# EAGLE design programmer (EAGLE 6.2)
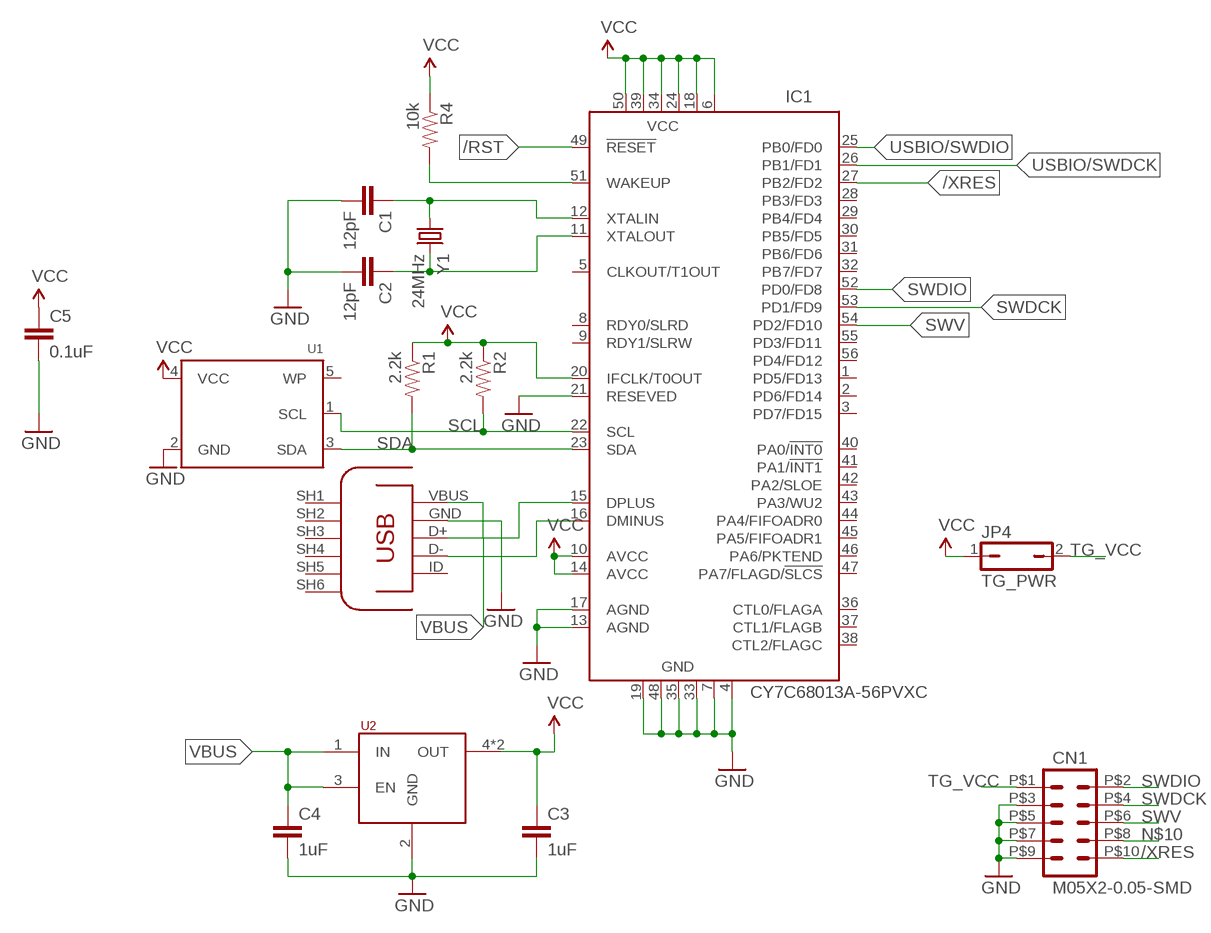
[diagram p0: schematic, sheet 1]

## Parts
C1  12pF  CAP0805  [0805]
C2  12pF  CAP0805  [0805]
C3  1uF  CAP0805  [0805]
C4  1uF  CAP0805  [0805]
C5  0.1uF  CAP0805  [0805]
CN1  M05X2-0.05-SMD  [PINHD-2X5-0.05-SMD]
IC1  CY7C68013A-56PVXC  [SSOP56]
JP4  TG_PWR  JP1Q  [JP1]
R1  2.2k  RESISTOR0805-RES  [0805]
R2  2.2k  RESISTOR0805-RES  [0805]
R4  10k  RESISTOR0805-RES  [0805]
U1  EEPROM_I2C_MCP24AA32  [SOT23-5]
U2  TLV702XX  [SOT23-5]
U$3  MICROUSB  [USB-MICROB]
Y1  24MHz  XRCGB_XTAL  [XRCGB-XTAL]

## Nets
/RST: IC1.49(!RESET)
/XRES: CN1.P$10 IC1.27(PB2/FD2)
GND: C1.2 C2.2 C3.2 C4.2 C5.2 CN1.P$3 CN1.P$5 CN1.P$7 CN1.P$9 IC1.4(GND) IC1.7(GND) IC1.13(AGND) IC1.17(AGND) IC1.19(GND) IC1.21(RESEVED) IC1.33(GND) IC1.35(GND) IC1.48(GND) U1.2(GND) U2.2(GND) U$3.GND
N$1: IC1.16(DMINUS) U$3.D-
N$2: IC1.15(DPLUS) U$3.D+
N$3: IC1.51(WAKEUP) R4.2
N$10: CN1.P$8
SCL: IC1.22(SCL) R2.2 U1.1(SCL)
SDA: IC1.23(SDA) R1.2 U1.3(SDA)
SWDCK: CN1.P$4 IC1.53(PD1/FD9)
SWDIO: CN1.P$2 IC1.52(PD0/FD8)
SWV: CN1.P$6 IC1.54(PD2/FD10)
TG_VCC: CN1.P$1 JP4.2
USBIO/SWDCK: IC1.26(PB1/FD1)
USBIO/SWDIO: IC1.25(PB0/FD0)
VBUS: C4.1 U2.1(IN) U2.3(EN) U$3.VBUS(VCC)
VCC: C3.1 C5.1 IC1.6(VCC) IC1.10(AVCC) IC1.14(AVCC) IC1.18(VCC) IC1.20(IFCLK/T0OUT) IC1.24(VCC) IC1.34(VCC) IC1.39(VCC) IC1.50(VCC) JP4.1 R1.1 R2.1 R4.1 U1.4(VCC) U2.4(OUT) U2.5(OUT)
XTALIN: C1.1 IC1.12(XTALIN) Y1.1
XTALOUT: C2.1 IC1.11(XTALOUT) Y1.2
Unconnected: IC1.1(PD5/FD13) IC1.2(PD6/FD14) IC1.3(PD7/FD15) IC1.5(CLKOUT/T1OUT) IC1.8(RDY0/SLRD) IC1.9(RDY1/SLRW) IC1.28(PB3/FD3) IC1.29(PB4/FD4) IC1.30(PB5/FD5) IC1.31(PB6/FD6) IC1.32(PB7/FD7) IC1.36(CTL0/FLAGA) IC1.37(CTL1/FLAGB) IC1.38(CTL2/FLAGC) IC1.40(PA0/!INT0) IC1.41(PA1/!INT1) IC1.42(PA2/SLOE) IC1.43(PA3/WU2) IC1.44(PA4/FIFOADR0) IC1.45(PA5/FIFOADR1) IC1.46(PA6/PKTEND) IC1.47(PA7/FLAGD/!SLCS) IC1.55(PD3/FD11) IC1.56(PD4/FD12) U1.5(WP) U$3.ID U$3.SH1(SH) U$3.SH2(SH) U$3.SH3(SH) U$3.SH4(SH) U$3.SH5(SH) U$3.SH6(SH)

## Library data of the parts
C1-C5 = SparkFun-Passives:CAP: Capacitor Standard 0603 ceramic capacitor, and 0.1" leaded capacitor.
CN1 = nickparts:M05X2-0.05-SMD
IC1 = my_cypress:CY7C6801*A-56: EZ-USB FX2LP (TM) USB Microcontroller Source: http://www.cypress.com .. cy7c68013a_5.pdf; MF: CYPRESS SEMICONDUCTOR CORPORAT; MPN: CY7C68013A-56PVXC; OC_FARNELL: 1269134; OC_NEWARK: 19M7114
JP4 = jumper:JP1Q: JUMPER
R1 R2 R4 = SparkFun-Passives:RESISTOR: Resistor Basic schematic elements and footprints for 0603, 1206, and PTH resistors.
U1 = microbuilder:EEPROM_I2C_MCP24AA32: Microchip 32K (4K x 8) 1.8V I2C EEPROM SOT23-5 [Digikey: 24AA32AFT-I/OTCT-ND]
U2 = nickparts:TLV702XX
U$3 = ondraster:MICROUSB
Y1 = nickparts:XRCGB_XTAL

## Board
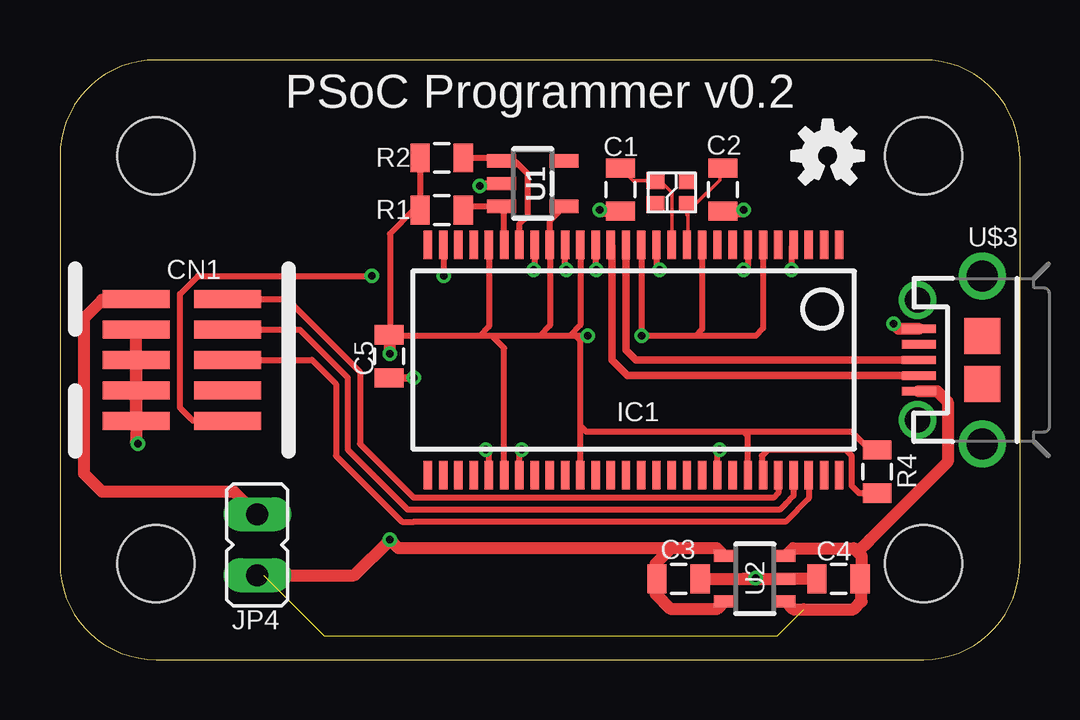
[diagram p1: board, top side]
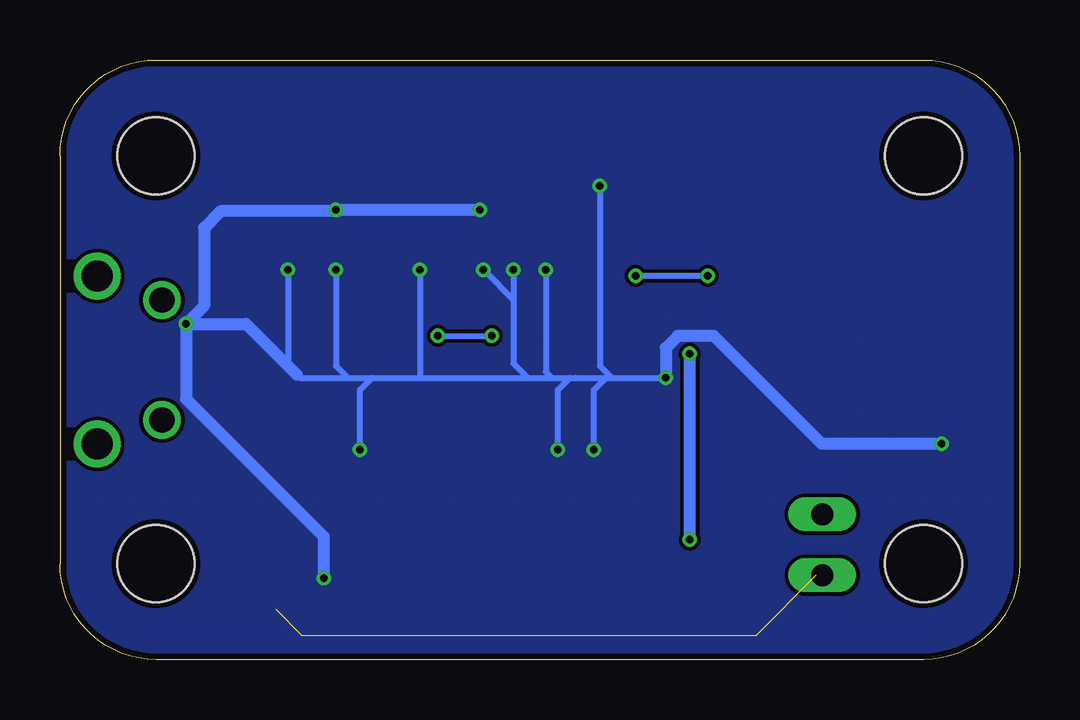
[diagram p2: board, bottom side, seen from below]

Size 40 x 25 mm. Coordinates in mm from the lower left corner, seen from the top.
Outline: 0,21 0,4 arc90 4,0 36,0 arc90 40,4 40,21 arc90 36,25 4,25 arc90 0,21
Copper layers (1*16): Top 0.035mm / dielectric 1.5mm / Bottom 0.035mm
Design rules: minimum track width 6mil, minimum drill 0.3mm, track to track 6mil, track to pad 6mil, pad to pad 6mil, via to via 6mil, smd to smd 0mil, copper to edge 10mil, drill to drill 10mil, minimum pad ring 10mil, minimum via ring 6mil, stop-mask expansion 2mil, vias tented up to drill 100mil, thermal gap 10mil
Holes 3.2 mm at 4,4 4,21 36,21 36,4
tKeepout: area 0,0 to 6,6; area 0,19 to 6,25; area 34,19 to 40,25; area 34,0 to 40,6; area 6,0 to 34,1.8; area 0,6 to 1.8,19; area 6,23.2 to 34,25; area 38.2,6 to 40,19
bKeepout: area 0,19 to 6,25; area 0,0 to 6,6; area 34,19 to 40,25; area 34,0 to 40,6; area 6,23.2 to 34,25; area 0,6 to 1.8,19; area 6,0 to 34,1.8; area 38.2,6 to 40,19; 1 lines
tRestrict: area 2,19 to 6,23; area 34,19 to 38,23; area 34,2 to 38,6; area 2,2 to 6,6

### Footprints (pad centres in the part's own frame; a part is rotated, then mirrored left to right if it is on the bottom)
0805 = smd 0.8 x 1.2: 1 -0.9,0; 2 0.9,0
PINHD-2X5-0.05-SMD = smd 2.794 x 0.737: P$1 1.27,5.08; P$2 5.08,5.08; P$3 1.27,3.81; P$4 5.08,3.81; P$5 1.27,2.54; P$6 5.08,2.54; P$7 1.27,1.27; P$8 5.08,1.27; P$9 1.27,0; P$10 5.08,0
SSOP56 = smd 0.35 x 1.2: 1 -8.572,-4.8; 2 -7.938,-4.8; 3 -7.303,-4.8; 4 -6.668,-4.8; 5 -6.032,-4.8; 6 -5.397,-4.8; 7 -4.763,-4.8; 8 -4.128,-4.8; 9 -3.493,-4.8; 10 -2.857,-4.8; 11 -2.223,-4.8; 12 -1.587,-4.8; 13 -0.953,-4.8; 14 -0.318,-4.8; 15 0.318,-4.8; 16 0.953,-4.8; 17 1.587,-4.8; 18 2.223,-4.8; 19 2.857,-4.8; 20 3.493,-4.8; 21 4.128,-4.8; 22 4.763,-4.8; 23 5.397,-4.8; 24 6.032,-4.8; 25 6.668,-4.8; 26 7.303,-4.8; 27 7.938,-4.8; 28 8.572,-4.8; 29 8.572,4.8; 30 7.938,4.8; 31 7.303,4.8; 32 6.668,4.8; 33 6.032,4.8; 34 5.397,4.8; 35 4.763,4.8; 36 4.128,4.8; 37 3.493,4.8; 38 2.857,4.8; 39 2.223,4.8; 40 1.587,4.8; 41 0.953,4.8; 42 0.318,4.8; 43 -0.318,4.8; 44 -0.953,4.8; 45 -1.587,4.8; 46 -2.223,4.8; 47 -2.857,4.8; 48 -3.493,4.8; 49 -4.128,4.8; 50 -4.763,4.8; 51 -5.397,4.8; 52 -6.032,4.8; 53 -6.668,4.8; 54 -7.303,4.8; 55 -7.938,4.8; 56 -8.572,4.8
JP1 = drill 0.914 long: 1 0,-1.27; 2 0,1.27
SOT23-5 = smd 0.55 x 1.2: 1 -0.95,-1.3; 2 0,-1.3; 3 0.95,-1.3; 4 0.95,1.3; 5 -0.95,1.3
SOT23-5' = smd 0.5 x 1: 1 -0.95,-1.2; 2 0,-1.2; 3 0.95,-1.2; 4 0.95,1.2; 5 -0.95,1.2
USB-MICROB = smd 0.35 x 1.4: D+ 0,2.65; D- -0.65,2.65; GND 1.3,2.65; ID 0.65,2.65; VBUS -1.3,2.65 | drill 1.3 pad 1.6: SH1 -3.5,0; SH2 3.5,0 | drill 1.05 pad 1.4: SH3 2.5,2.7; SH4 -2.5,2.7 | smd 1.5 x 1.5: SH5 -1,0; SH6 1,0
XRCGB-XTAL = smd 0.75 x 0.7: 1 -0.675,0.5; 2 0.675,-0.5; NC1 0.675,0.5; NC2 -0.675,-0.5

### Placement (x,y rotation side)
C1  23.37,19.59 270 top
C2  27.63,19.59 270 top
C3  25.79,3.37 0 top
C4  32.46,3.37 180 top
C5  13.72,12.64 270 top
CN1  1.91,9.95 0 top
IC1  23.91,12.49 180 top
JP4  8.22,4.79 0 top
R1  15.91,18.75 0 top
R2  15.91,20.92 0 top
R4  34.06,7.83 270 top
U1  19.71,19.84 270 top
U2  TLV702XX  [SOT23-5']  28.96,3.37 90 top
U$1  [OSHW-LOGO-S]  32,21 0 top
U$3  38.45,12.49 90 top
Y1  25.5,19.48 0 top

### Tracks (layer width: path | path; a pad name or v marks a point on that pad's centre or on a via)
/XRES  (via drill 0.3)
  Top 0.254: CN1.P$10 5.55,9.95 5,10.5 5,15.25 5.75,16 v13,16 | v16,16 16,17.27 IC1.27
  Bottom 0.254: v13,16 v16,16
GND  (via drill 0.3)
  Top 0.254: IC1.21 19.79,16.29 | IC1.19 21.05,16.3 v21.1,16.25 | U1.2 17.59,19.84 v17.5,19.75 | IC1.33 17.88,8.62 v17.75,8.75 | IC1.35 19.15,8.65 v19.25,8.75 | IC1.48 27.41,8.65 v27.5,8.75 | v30.5,16.25 30.5,17.21 IC1.4 | IC1.7 28.68,16.43 v28.5,16.25 | IC1.13 24.86,16.39 v25,16.25 | IC1.17 22.32,16.32 v22.35,16.25
  Top 0.305: v14.75,11.75 C5.2
  Top 0.406: C5.2 | 19.79,16.29 v19.75,16.25
  Top 0.508: C4.2 U2.2 29,3.37 | 28.5,3.37 C3.2 28.97,3.37 v29,3.4 | 28.5,3.37 29,3.37 | U$3.GND 34.96,13.79 v34.75,14 | 29,3.37 28.5,3.37 | C1.2 22.55,18.7 v22.5,18.75 | C2.2 28.45,18.7 v28.5,18.75 | CN1.P$9 CN1.P$7 CN1.P$5 | CN1.P$5 CN1.P$3 | CN1.P$5 3.17,9.07 v3.25,9
  Bottom 0.254: 20.5,11.75 21,12.25 21.1,12.35 21.1,15 | 20.5,11.75 19.5,11.75 | 19.5,11.75 18.75,11.75 | 18.75,11.75 18.5,11.75 17.25,11.75 | 17.25,11.75 17,11.75 | 17,11.75 v14.75,11.75 | v19.75,16.25 19.75,12 19.5,11.75 | v21.1,16.25 21.1,15 | 28,11.75 28.25,11.75 30,11.75 30.12,11.88 30.5,12.25 v30.5,16.25 | 28,11.75 27,11.75 | 27,11.75 25,11.75 | 25,11.75 20.5,11.75 | v17.75,8.75 17.75,11.25 17.25,11.75 | v19.25,8.75 19.25,11.25 18.75,11.75 | v27.5,8.75 27.5,11.25 27,11.75 | v17.5,19.75 17.5,12.25 17,11.75 | v28.5,16.25 28.5,12.25 28,11.75 | v25,16.25 25,11.75 | v22.35,16.25 22.25,16.15 21.1,15
  Bottom 0.508: v34.75,14 34.75,10.87 29,5.12 v29,3.4 | v22.5,18.75 v28.5,18.75 | v3.25,9 8.25,9 12.75,13.5 14.25,13.5 14.75,13 v14.75,11.75 | v34.75,14 32.25,14 30.12,11.88 | 28.45,18.7 33.3,18.7 34,18 34,14.75 v34.75,14
  pour Bottom (hatched): 0,0 40,0 40,25 0,25
N$1
  Top 0.32: U$3.D- 23.66,11.84 23,12.5 23,17.25 IC1.16
N$2
  Top 0.32: IC1.15 23.59,12.9 24,12.5 U$3.D+
N$3
  Top 0.254: R4.2 33.31,6.93 33,7.25 33,8.5 32.75,8.75 29.5,8.75 29.25,8.5 29.25,7.75 IC1.51
SCL
  Top 0.254: R2.2 18.29,20.92 U1.1 18.45,20.75 19,20.75 19.5,20.25 19.5,18.5 19.15,18.15 IC1.22
SDA
  Top 0.254: R1.2 16.96,18.89 U1.3 18.52,18.79 IC1.23
SWDCK
  Top 0.254: IC1.53 30.58,6.83 30.25,6.5 30,6.25 14.75,6.25 14.5,6.25 12,8.75 12,11.75 9.99,13.76 CN1.P$4
SWDIO
  Top 0.254: IC1.52 29.95,6.95 29.75,6.75 14.75,6.75 12.5,9 12.5,12 9.47,15.03 CN1.P$2
SWV
  Top 0.254: IC1.54 31.21,6.71 30.25,5.75 14.75,5.75 14.25,5.75 11.5,8.5 11.5,11.5 10.51,12.49 CN1.P$6
TG_VCC
  Top 0.508: JP4.2 8.2,6.05 7.25,7 1.75,7 1,7.75 1,14.25 1.75,15 3.15,15 CN1.P$1
VBUS  (3 unrouted)
  Top 0.508: U2.1 30.23,2.42 30.55,2.1 31,2.1 33.09,2.1 33.41,2.42 33.41,3.32 C4.1 33.41,3.42 33.41,4.32 33.24,4.49 | U2.3 30.23,4.32 30.55,4.64 33.09,4.64 33.24,4.49 | U$3.VBUS 36.56,11.19 37,10.75 37,8.25 33.75,5 33.24,4.49
VCC  (via drill 0.3)
  Top 0.254: IC1.24 17.88,13.88 17.5,13.5 16.75,13.5 | 16.75,13.5 13.77,13.5 | IC1.18 21.69,13.94 21.25,13.5 20.75,13.5 | 20.75,13.5 20,13.5 | 20,13.5 18,13.5 | 18,13.5 16.75,13.5 | 20,13.5 20.42,13.92 IC1.20 20.42,18.3 U1.4 | IC1.14 24.23,13.52 v24.25,13.5 25.75,13.5 | v22,13.5 21.5,13.5 | 21.5,13.5 20.75,13.5 | IC1.10 26.77,13.77 26.5,13.5 25.75,13.5 | IC1.6 29.31,13.81 29,13.5 25.75,13.5 | IC1.39 21.69,9.25 21.69,9.5 21.69,9.75 | 21.69,9.75 21.69,13.31 21.5,13.5 | IC1.34 18.52,12.98 18,13.5 | R2.1 R1.1 14.74,18.75 13.75,17.75 13.75,13.57 C5.1 | R4.1 33.77,8.73 33,9.5 28.5,9.5 | 28.5,9.5 21.94,9.5 21.69,9.75 | IC1.50 28.68,9.32 28.5,9.5
  Top 0.406: 13.77,13.5 C5.1
  Top 0.508: U2.4 27.7,4.32 27.38,4.64 | 27.38,4.64 25.47,4.64 24.84,4 24.84,3.42 C3.1 24.84,3.32 24.84,2.73 25.47,2.1 27.38,2.1 27.7,2.42 U2.5 | 27.38,4.64 14.11,4.64 v13.75,5 12.27,3.52 JP4.1 | v13.75,12.75 13.75,13.52 C5.1
  Bottom 0.254: v24.25,13.5 v22,13.5
  Bottom 0.508: v13.75,5 v13.75,12.75
XTALIN
  Top 0.152: 25,19.98 25.5,19.48 25.5,18.52 IC1.12 | Y1.1 23.89,19.98 C1.1
  Top 0.32: Y1.1 25,19.98
XTALOUT
  Top 0.152: 26.14,18.52 26.14,18.93 Y1.2 | IC1.11 26.18,17.29 Y1.2 | Y1.2 26.48,18.98 27.5,20 27.5,20.36 C2.1

### Text on the board
tNames: PSoC Programmer v0.2